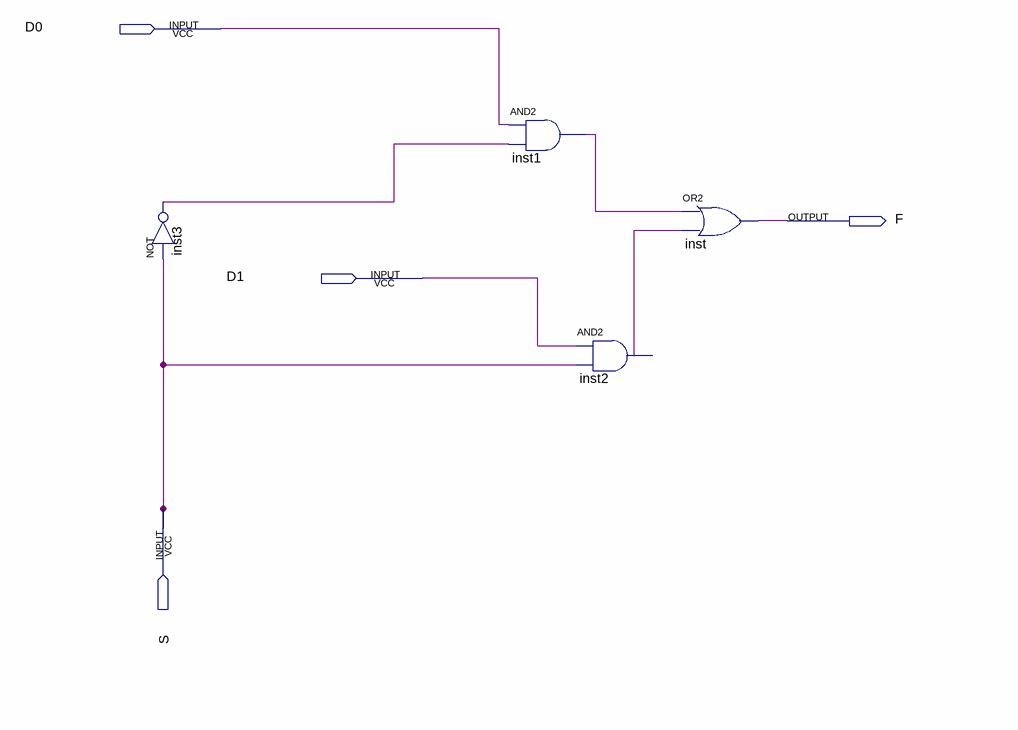
[diagram p0: schematic sheet]
// Quartus schematic MuxDemo.bdf as structural Verilog: 4 symbols, 4 pins
module MuxDemo (
  input  D0,
  input  D1,
  input  S,
  output F
);

  wire inst1_out, inst2_out, inst3_out;

  not inst3 (inst3_out, S);
  and inst1 (inst1_out, D0, inst3_out);
  and inst2 (inst2_out, D1, S);
  or inst (F, inst1_out, inst2_out);
endmodule
